# Altium schematic sheet CMSIS-DAP_JX+copy.schdoc
size A3
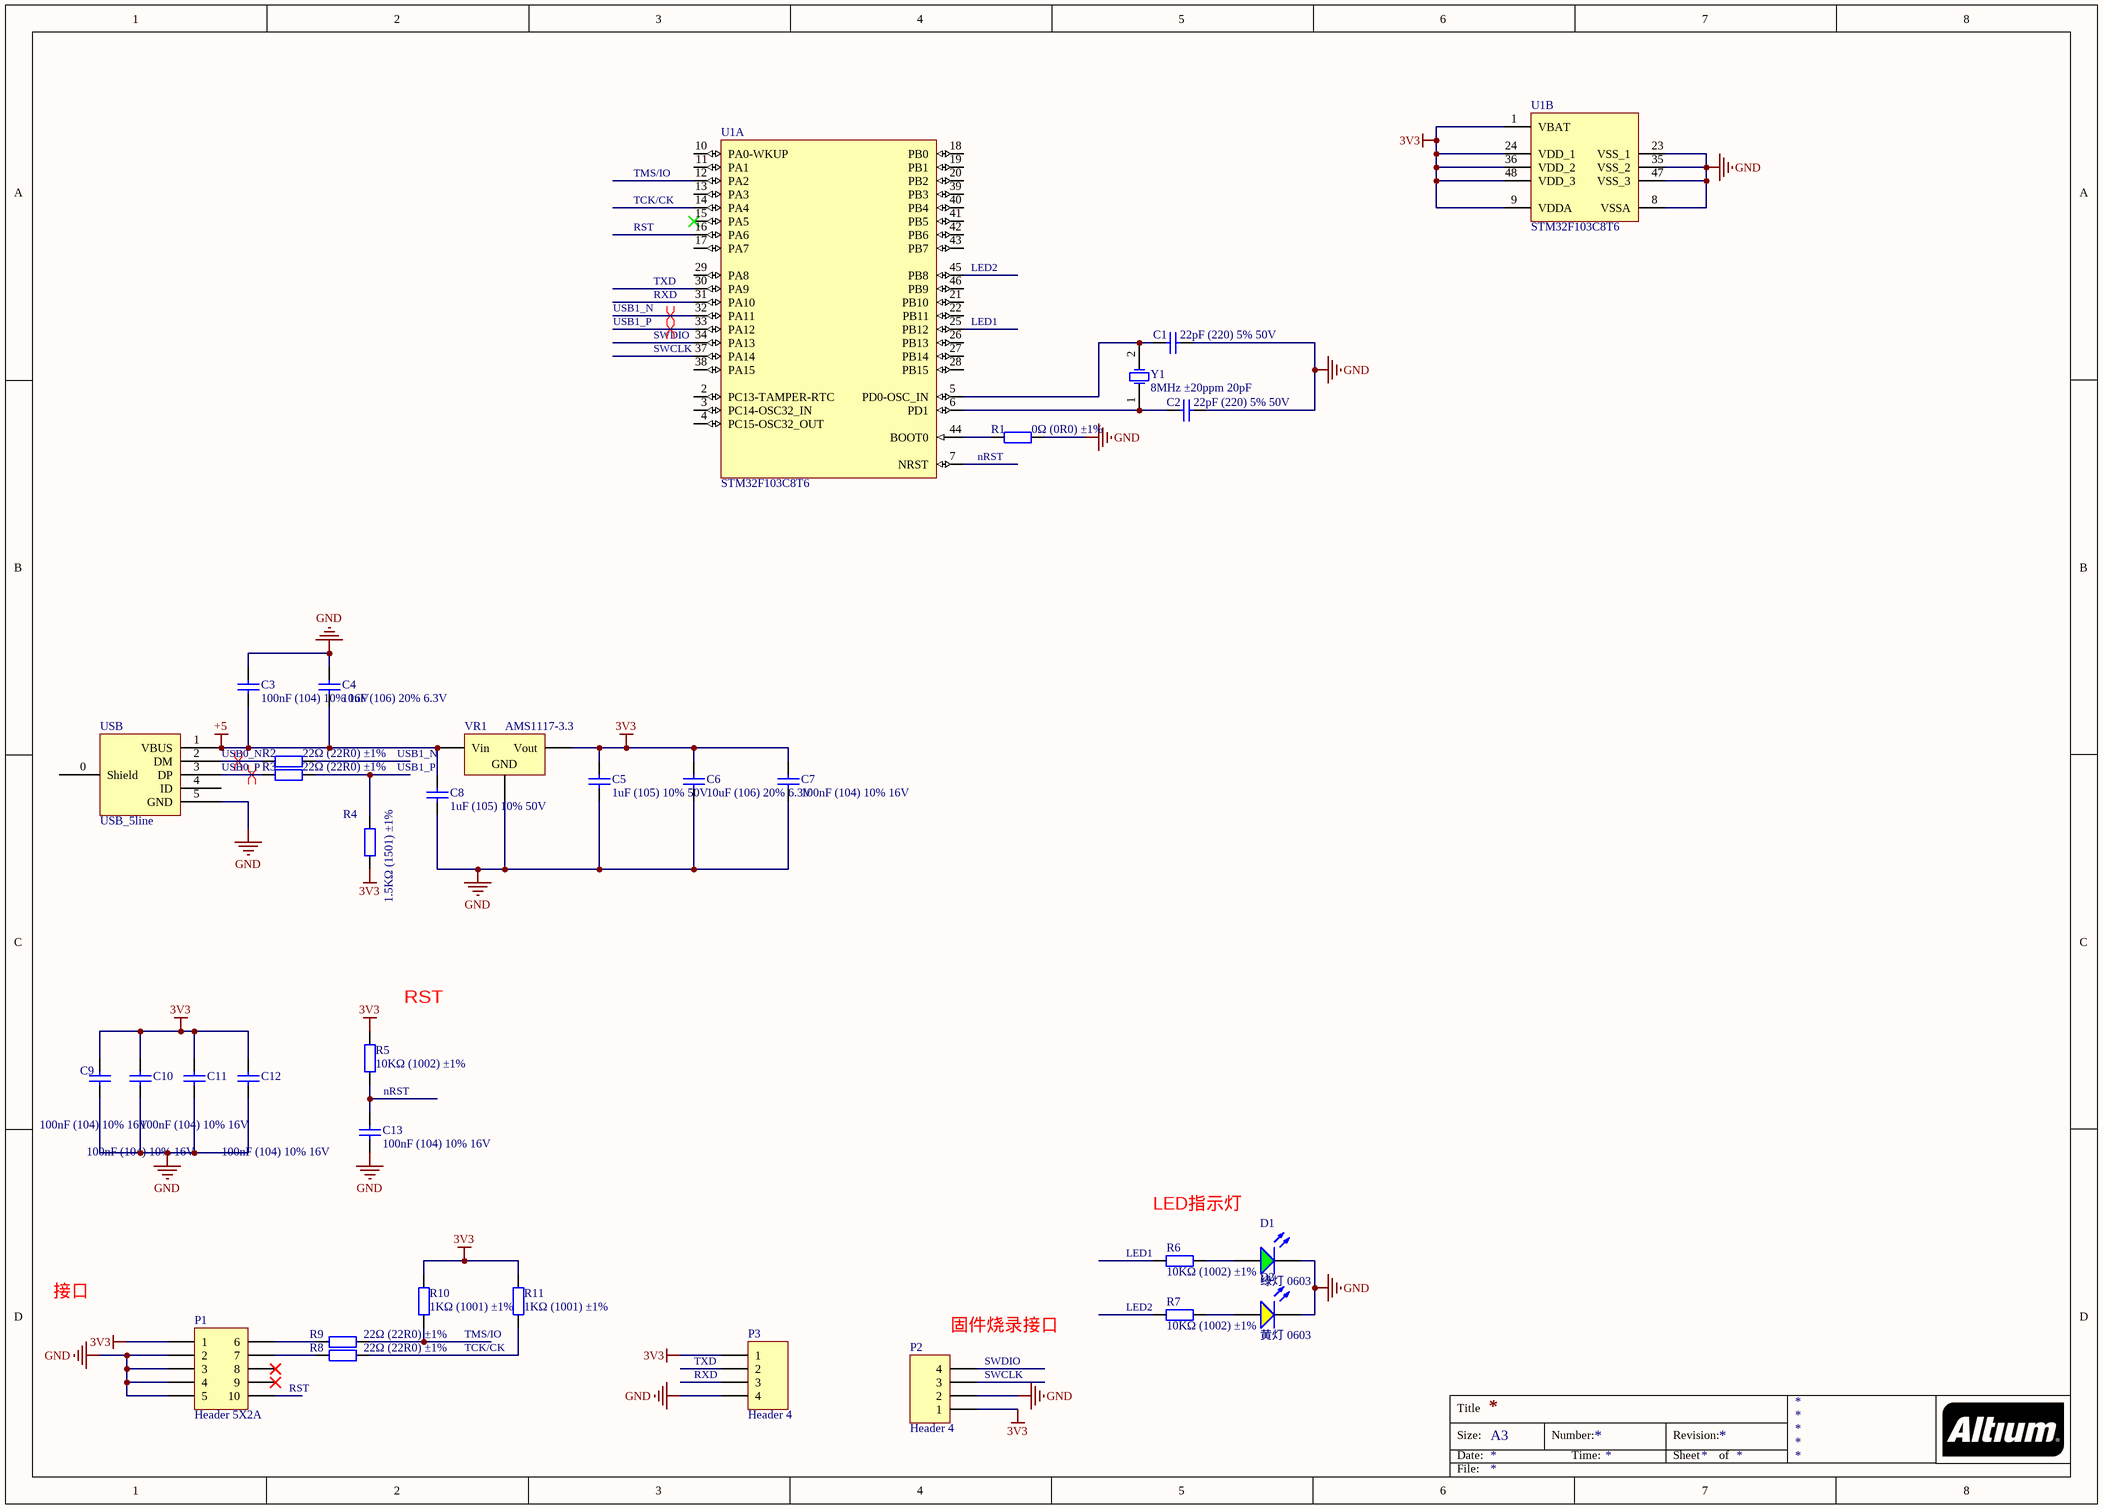
[diagram p0: CMSIS-DAP_JX+copy.schdoc]

## Parts
C1  22pF (220) 5% 50V  [0402_C]
C2  22pF (220) 5% 50V  [0402_C]
C3  100nF (104) 10% 16V  [0402_C]
C4  10uF (106) 20% 6.3V  [0402_C]
C5  1uF (105) 10% 50V  [0603_C]
C6  10uF (106) 20% 6.3V  [0402_C]
C7  100nF (104) 10% 16V  [0402_C]
C8  1uF (105) 10% 50V  [0603_C]
C9  100nF (104) 10% 16V  [0402_C]
C10  100nF (104) 10% 16V  [0402_C]
C11  100nF (104) 10% 16V  [0402_C]
C12  100nF (104) 10% 16V  [0402_C]
C13  100nF (104) 10% 16V  [0402_C]
D1  绿灯 0603  [0603_LED_S1]
D2  黄灯 0603  [0603_LED_S1]
P1  Header 5X2A  [SMT HEADER 5*2]
P2  Header 4  [HDR1X4]
P3  Header 4  [HDR1X4]
R1  0Ω (0R0) ±1%  [0402_R]
R2  22Ω (22R0) ±1%  [0402_R]
R3  22Ω (22R0) ±1%  [0402_R]
R4  1.5KΩ (1501) ±1%  [0402_R]
R5  10KΩ (1002) ±1%  [0402_R]
R6  10KΩ (1002) ±1%  [0402_R]
R7  10KΩ (1002) ±1%  [0402_R]
R8  22Ω (22R0) ±1%  [0402_R]
R9  22Ω (22R0) ±1%  [0402_R]
R10  1KΩ (1001) ±1%  [0402_R]
R11  1KΩ (1001) ±1%  [0402_R]
U1  STM32F103C8T6  [LQFP-48_7x7x05P]  (parts A,B of 2)
USB  USB_5line  [USB-MICRO-5P-2F]
VR1  AMS1117-3.3  [SOT-223]
Y1  8MHz ±20ppm 20pF  [SMD-5032_2P]

## Nets
3V3: C5.2 C6.2 C7.2 C9.2 C10.2 C11.2 C12.2 P1.1 P2.1 P3.1 R4.1 R5.2 R10.2 R11.2 U1.1(VBAT) U1.9(VDDA) U1.24(VDD_1) U1.36(VDD_2) U1.48(VDD_3) VR1.2(Vout)
+5: C3.1 C4.1 C8.2 USB.1(VBUS) VR1.3(Vin)
GND: C1.2 C2.2 C3.2 C4.2 C5.1 C6.1 C7.1 C8.1 C9.1 C10.1 C11.1 C12.1 C13.1 D1.K D2.K P1.2 P1.3 P1.4 P1.5 P2.2 P3.4 R1.2 U1.8(VSSA) U1.23(VSS_1) U1.35(VSS_2) U1.47(VSS_3) USB.5(GND) VR1.1(GND)
LED1: R6.1 U1.25(PB12)
LED2: R7.1 U1.45(PB8)
nRST: C13.2 R5.1 U1.7(NRST)
RST: P1.10 U1.16(PA6)
RXD: P3.3 U1.31(PA10)
SWCLK: P2.3 U1.37(PA14)
SWDIO: P2.4 U1.34(PA13)
TCK/CK: R8.2 R11.1 U1.14(PA4)
TMS/IO: R9.2 R10.1 U1.12(PA2)
TXD: P3.2 U1.30(PA9)
USB0_N: R2.1 USB.2(DM)
USB0_P: R3.1 USB.3(DP)
USB1_N: R2.2 U1.32(PA11)
USB1_P: R3.2 R4.2 U1.33(PA12)
NetC1_1: C1.1 U1.5(PD0-OSC_IN) Y1.2(OSC2)
NetC2_1: C2.1 U1.6(PD1) Y1.1(OSC1)
NetD1_A: D1.A R6.2
NetD2_A: D2.A R7.2
NetP1_6: P1.6 R9.1
NetP1_7: P1.7 R8.1
NetR1_1: R1.1 U1.44(BOOT0)

Not connected (* = marked no-connect by the designer): P1 8* 9*; U1 2(PC13-TAMPER-RTC) 3(PC14-OSC32_IN) 4(PC15-OSC32_OUT) 10(PA0-WKUP) 11(PA1) 13(PA3) 15(PA5)* 17(PA7) 18(PB0) 19(PB1) 20(PB2) 21(PB10) 22(PB11) 26(PB13) 27(PB14) 28(PB15) 29(PA8) 38(PA15) 39(PB3) 40(PB4) 41(PB5) 42(PB6) 43(PB7) 46(PB9); USB 0(Shield) 4(ID)

## Layout directives
differential pair: USB0_N, USB0_P, USB1_N, USB1_P

## Notes on the sheet
- (near R5) RST
- LED指示灯
- 接口
- (near P2) 固件烧录接口
- Title
- Size:
- Date:
- A3
- Number:
- Time:
- Revision:
- Sheet
- of
- File:

## Library data of the parts
C1 C2 = 0402 22pF (220) 5% 50V: 贴片电容; ComponentLink1Description: 供应商链接; ComponentLink1URL: http://www.szlcsc.com/product/details_1907.html; Package: 0402; Supplier: LC; SuppliersPartNumber: C1555
C3 C7 C9-C13 = 0402 100nF (104) 10% 16V: 贴片电容; ComponentLink1Description: 供应商链接; ComponentLink1URL: http://www.szlcsc.com/product/details_1877.html; Package: 0402; Supplier: LC; SuppliersPartNumber: C1525
C4 C6 = 0402 10uF (106) 20% 6.3V: 贴片电容; ComponentLink1Description: 供应商链接; ComponentLink1URL: http://www.szlcsc.com/product/details_16204.html; Package: 0402; Supplier: LC; SuppliersPartNumber: C15525
C5 C8 = 0603 1uF (105) 10% 50V: 贴片电容; ComponentLink1Description: 供应商链接; ComponentLink1URL: http://www.szlcsc.com/product/details_16531.html; Package: 0603; Supplier: LC; SuppliersPartNumber: C15849
D1 = 0603 绿灯: 发光二极管; ComponentLink1Description: 供应商链接; ComponentLink1URL: http://www.szlcsc.com/product/details_73152.html; Package: 0603; Supplier: LC; SuppliersPartNumber: C72043
D2 = 0603 黄灯: 发光二极管; ComponentLink1Description: 供应商链接; ComponentLink1URL: http://www.szlcsc.com/product/details_73147.html; Package: 0603; Supplier: LC; SuppliersPartNumber: C72038
P1 = Header 5X2A: Header, 5-Pin, Dual row; LatestRevisionDate: 17-Jul-2002; LatestRevisionNote: Re-released for DXP Platform.; Publisher: Altium Limited
P2 P3 = Header 4: Header, 4-Pin; LatestRevisionDate: 17-Jul-2002; LatestRevisionNote: Re-released for DXP Platform.; Publisher: Altium Limited
R1 = 0402 0Ω (0R0) 1%: 贴片电阻; ComponentLink1Description: 供应商链接; ComponentLink1URL: http://www.szlcsc.com/product/details_17853.html; Package: 0402; Supplier: LC; SuppliersPartNumber: C17168
R2 R3 R8 R9 = 0402 22Ω (22R0) 1%: 贴片电阻; ComponentLink1Description: 供应商链接; ComponentLink1URL: http://www.szlcsc.com/product/details_25835.html; Package: 0402; Supplier: LC; SuppliersPartNumber: C25092
R4 = 0402 1.5KΩ (1501) 1%: 贴片电阻; ComponentLink1Description: 供应商链接; ComponentLink1URL: http://www.szlcsc.com/product/details_26610.html; Package: 0402; Supplier: LC; SuppliersPartNumber: C25867
R5-R7 = 0402 10KΩ (1002) 1%: 贴片电阻; ComponentLink1Description: 供应商链接; ComponentLink1URL: http://www.szlcsc.com/product/details_26487.html; Package: 0402; Supplier: LC; SuppliersPartNumber: C25744
R10 R11 = 0402 1KΩ (1001) 1%: 贴片电阻; ComponentLink1Description: 供应商链接; ComponentLink1URL: http://www.szlcsc.com/product/details_12256.html; Package: 0402; Supplier: LC; SuppliersPartNumber: C11702
U1 = STM32F103C8T6: ARM; ComponentLink1Description: 供应商链接; ComponentLink1URL: http://www.szlcsc.com/product/details_9243.html; Package: LQFP-48_7x7x05P; Supplier: LC; SuppliersPartNumber: C8734
VR1 = SOT-223 AMS1117-3.3: 低压差线性稳压(LDO); ComponentLink1Description: 供应商链接; ComponentLink1URL: http://www.szlcsc.com/product/details_6652.html; Package: SOT-223; Supplier: LC; SuppliersPartNumber: C6186
Y1 = SMD-5032_2P 8MHz 20ppm 20pF: 贴片晶振; ComponentLink1Description: 供应商链接; ComponentLink1URL: http://www.szlcsc.com/product/details_117214.html; Package: SMD-5032_2P; Supplier: LC; SuppliersPartNumber: C115962